# EAGLE schematic bilancia_smart_pezzi_amp (EAGLE 7.3.0)
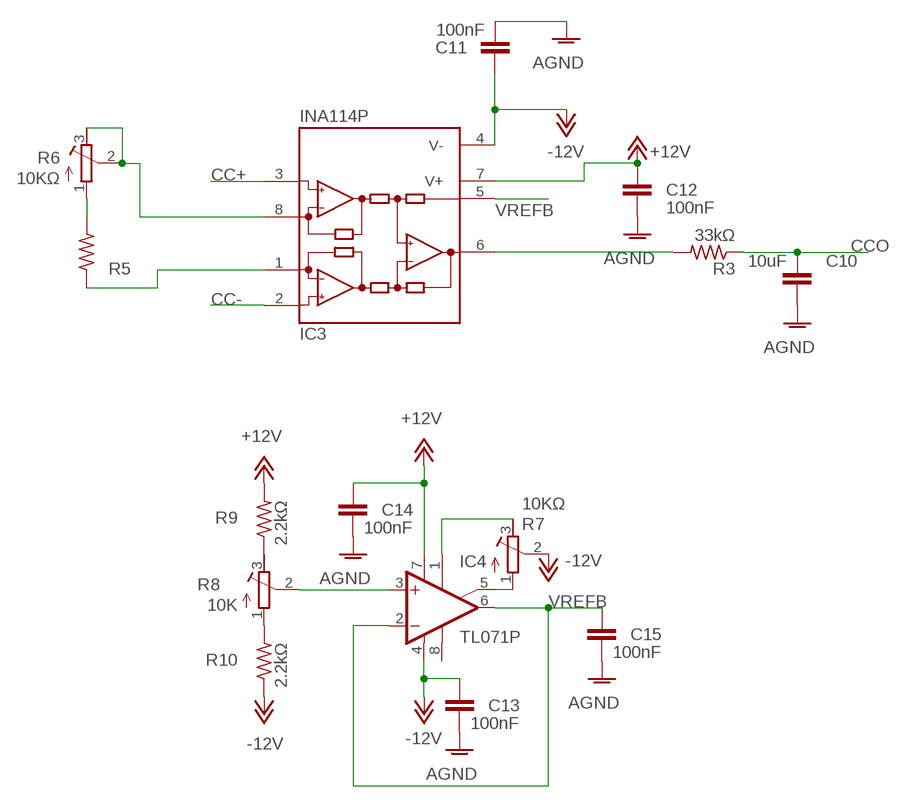
[diagram p0: schematic, sheet 1]

## Parts
C10  10uF  C2.5/2  [C2.5-2]
C11  100nF  C2.5/2  [C2.5-2]
C12  100nF  C2.5/2  [C2.5-2]
C13  100nF  C2.5/2  [C2.5-2]
C14  100nF  C2.5/2  [C2.5-2]
C15  100nF  C2.5/2  [C2.5-2]
IC3  INA114P  [DIL08]
IC4  TL071P  [DIL08]
R3  33kΩ  R-US_0207/10  [0207/10]
R5  R-US_0207/10  [0207/10]
R6  10KΩ  R-TRIMM64W  [RTRIM64W]
R7  10KΩ  R-TRIMM64W  [RTRIM64W]
R8  10K  R-TRIMM64W  [RTRIM64W]
R9  2.2kΩ  R-US_0207/10  [0207/10]
R10  2.2kΩ  R-US_0207/10  [0207/10]

## Nets
+12V [massa]: C12.2 C14.2 IC3.7(V+) IC4.7(V+) R9.2
-12V [massa]: C11.2 C13.2 IC3.4(V-) IC4.4(V-) R7.2(S) R10.1
AGND [massa]: C10.1 C11.1 C12.1 C13.1 C14.1 C15.1
CC+: IC3.3(+IN)
CC-: IC3.2(-IN)
CCO: C10.2 R3.1
N$7: IC3.6(OUT) R3.2
N$9: R5.2 R6.1(E)
N$10: IC3.8(RG) R6.2(S) R6.3(A)
N$11: IC3.1(RG) R5.1
N$12: IC4.5(ON2) R7.1(E)
N$13: IC4.1(ON1) R7.3(A)
N$15: R8.3(A) R9.1
N$16: R8.1(E) R10.2
N$17: IC4.3(+IN) R8.2(S)
VREFB: C15.2 IC3.5(REF) IC4.2(-IN) IC4.6(OUT)
Unconnected: IC4.8(OPT)

## Library data of the parts
C10-C15 = capacitor-wima:C: CAPACITOR naming: grid - package width
IC3 = burr-brown:INA114: Precision Instrumentation Amplifier; MF: TEXAS INSTRUMENTS; MPN: INA114BP; OC_FARNELL: 1212399; OC_NEWARK: 74K3810
IC4 = linear:TL071: OP AMP
R3 R5 R9 R10 = resistor:R-US_: RESISTOR, American symbol
R6-R8 = resistor:R-TRIMM: Trimm resistor

## Net classes
0 default: clearance 0.205 mm
1 massa: width 0.5 mm, clearance 0.205 mm